# Altium schematic sheet AFE.SchDoc (part 2 of 3)
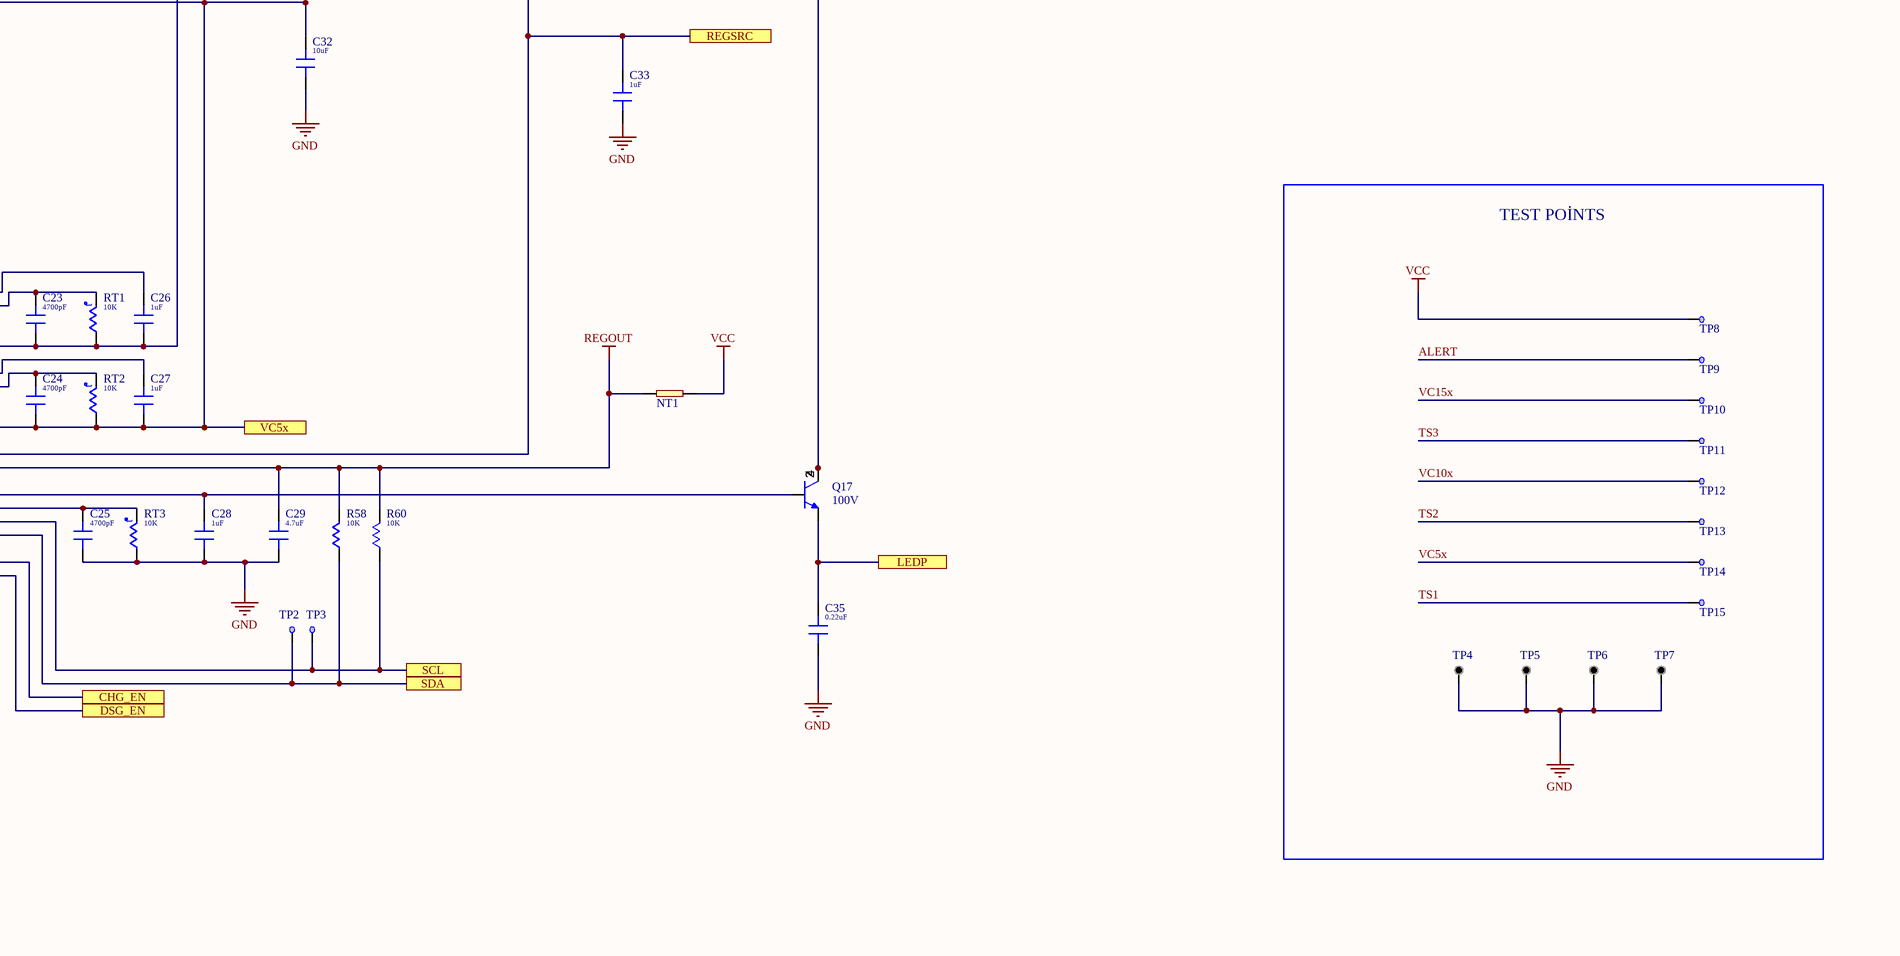
[diagram p4: AFE.SchDoc, bottom right]
## Library data of the parts
C1-C18 C35 = C_0.22uF_0603_16V: Ceramic Capacitor 220nF, 16VDC, 0603, ±10 %; Manufacturer: Wurth Electronics; Insulation Resistance: 2.3GR; Supplier: Mouser; Supplier Part Number: 710-885012206048; Manufacturer Part Number: 885012206048; RoHS: Yes; Category: Ceramic Capacitors; Stock: 28778; Pricing: 1=0,1, 10=0,044, 50=0,044, 100=0,04, 1000=0,035, 10000=0,029 (USD); Height: 800um; ComponentLink1URL: http://www.farnell.com/datasheets/1995922.pdf?src-supplier=Farnell; ComponentLink1Description: http://www.farnell.com/datasheets/1995922.pdf?src-supplier=Farnell; ComponentLink2URL: https://katalog.we-online.de/pbs/datasheet/885012206048.pdf?src-supplier=Digikey; ComponentLink2Description: https://katalog.we-online.de/pbs/datasheet/885012206048.pdf?src-supplier=Digikey; ComponentLink3URL: https://datasheet.octopart.com/885012206048-W%C3%BCrth-Elektronik-datasheet-61282229.pdf?src-supplier=Element14; ComponentLink3Description: https://datasheet.octopart.com/885012206048-W%C3%BCrth-Elektronik-datasheet-61282229.pdf?src-supplier=Element14
C19 C20 C22 = C_0.1uF_0603_50V: Ceramic Capacitor, Multilayer, Ceramic, 50V, 10% -Tol, X7R, 15% Tc, 0.1Uf, Surface Mount, 0603; Manufacturer: TDK; Material: 4241ConductorMaterial; Supplier: Mouser; Supplier Part Number: 810-C1608X7R1H104K; Manufacturer Part Number: C1608X7R1H104K080AA; RoHS: Yes; Category: Ceramic Capacitors; Stock: 870852; Pricing: 1=0,1, 10=0,041, 50=0,041, 100=0,024, 1000=0,018, 10000=0,015 (USD); Mounting Technology: Surface Mount; Case/Package: 0603; Pins: 2NUMBER; Case Code (Imperial): 0603; Case Code (Metric): 1608; Dielectric Material: 4241ConductorMaterial; Min Operating Temperature: -55°C; Max Operating Temperature: 125°C; Voltage Rating: 50V; Tolerance: 10%; Packaging: Tape and Reel; Package Quantity: 1; Dielectric: X7R; Termination: SMD/SMT; Voltage: 50V; Series: C; Construction: Flat; Length: 1.6mm; Width: 0.031inch; Height: 0.8mm; Thickness: 0.037inch; Depth: 0.8mm; Reach SVHC Compliant: No; RoHS Compliant: Yes; Lead Free: 5697LeadFree
C21 C36 = C_470pF_0603_50V: WCAP-CSGP 0603 (1608Metric) Ceramic Capacitor 0.063Lx0.031W 1.60mmx0.80mm X7R ±10% 470pF; Manufacturer: Wurth Electronics; Dielectric: 1511DielectricType; Insulation Resistance: 10GR; Voltage Rating (DC): 50V; Supplier: Digikey; Supplier Part Number: 732-7999-1-ND; Manufacturer Part Number: 885012206081; RoHS: Yes; Category: Ceramic Capacitors; Stock: 6003; Pricing: 1=0,1, 10=0,025, 100=0,023, 500=0,02 (USD); Height: 800um; ComponentLink1URL: http://www.farnell.com/datasheets/2031849.pdf?src-supplier=Farnell; ComponentLink1Description: http://www.farnell.com/datasheets/2031849.pdf?src-supplier=Farnell; ComponentLink2URL: http://www.farnell.com/datasheets/2031849.pdf?src-supplier=Newark; ComponentLink2Description: http://www.farnell.com/datasheets/2031849.pdf?src-supplier=Newark; ComponentLink3URL: http://katalog.we-online.de/pbs/datasheet/885012206081.pdf?src-supplier=Digikey; ComponentLink3Description: http://katalog.we-online.de/pbs/datasheet/885012206081.pdf?src-supplier=Digikey; ComponentLink4URL: https://katalog.we-online.de/pbs/datasheet/885012206081.pdf?src-supplier=Digikey; ComponentLink4Description: https://katalog.we-online.de/pbs/datasheet/885012206081.pdf?src-supplier=Digikey
C23-C25 = C_4700pF_0603_50V: Cap Cer 4700PF 50V X7R 0603; Manufacturer: Wurth Electronics; Tolerance: 10%; Insulation Resistance: 10GR; Supplier: Mouser; Supplier Part Number: 710-885012206087; Manufacturer Part Number: 885012206087; RoHS: Yes; Category: Ceramic Capacitors; Stock: 9914; Pricing: 1=0,1, 10=0,02, 50=0,02, 100=0,018, 1000=0,015, 10000=0,012 (USD); Mounting Technology: Surface Mount; Case/Package: 0603; Case Code (Metric): 1608; Case Code (Imperial): 0603; Min Operating Temperature: -55°C; Max Operating Temperature: 125°C; Packaging: Cut Tape; Voltage Rating: 50V; Dielectric: X7R; Voltage Rating (DC): 50V; Series: WCAP-CSGP; Length: 0.063inch; Width: 0.031inch; Height: 800um; Thickness: 0.037inch; RoHS Compliant: Yes; Reach SVHC Compliant: Unknown; ComponentLink1URL: http://www.farnell.com/datasheets/1958481.pdf?src-supplier=Farnell; ComponentLink1Description: http://www.farnell.com/datasheets/1958481.pdf?src-supplier=Farnell; ComponentLink2URL: https://datasheet.octopart.com/885012206087-W%C3%BCrth-Elektronik-datasheet-62053755.pdf?src-supplier=Element14; ComponentLink2Description: https://datasheet.octopart.com/885012206087-W%C3%BCrth-Elektronik-datasheet-62053755.pdf?src-supplier=Element14; ComponentLink3URL: https://katalog.we-online.de/pbs/datasheet/885012206087.pdf?src-supplier=Digikey; ComponentLink3Description: https://katalog.we-online.de/pbs/datasheet/885012206087.pdf?src-supplier=Digikey; ComponentLink4URL: http://www.farnell.com/datasheets/1958481.pdf?src-supplier=Newark; ComponentLink4Description: http://www.farnell.com/datasheets/1958481.pdf?src-supplier=Newark
C26-C28 = C_1uF_0603_16V: Capacitor, 1uF Multilayer Ceramic MLCC 16 V , X7R Dielectric 0603 Surface Mount | Wurth Electronics 885012206052; Material: 4241ConductorMaterial; Voltage Rating: 16V; Tolerance: 10%; Insulation Resistance: 100MR; Supplier: Mouser; Supplier Part Number: 710-885012206052; Manufacturer: Wurth Electronics; Manufacturer Part Number: 885012206052; RoHS: Yes; Category: Ceramic Capacitors; Stock: 13778; Pricing: 1=0,16, 10=0,153, 50=0,153, 100=0,141, 1000=0,123, 10000=0,11 (USD); Mounting Technology: Surface Mount; Case/Package: 0603; Case Code (Metric): 1608; Case Code (Imperial): 0603; Min Operating Temperature: -55°C; Max Operating Temperature: 125°C; Packaging: Cut Tape; Dielectric: X7R; Series: WCAP-CSGP; Voltage Rating (DC): 16V; Length: 0.063inch; Width: 0.031inch; Height: 800um; Thickness: 0.037inch; RoHS Compliant: Yes; Reach SVHC Compliant: Unknown; ComponentLink1URL: http://www.farnell.com/datasheets/1958472.pdf?src-supplier=Farnell; ComponentLink1Description: http://www.farnell.com/datasheets/1958472.pdf?src-supplier=Farnell; ComponentLink2URL: http://www.farnell.com/datasheets/1958472.pdf?src-supplier=Element14; ComponentLink2Description: http://www.farnell.com/datasheets/1958472.pdf?src-supplier=Element14; ComponentLink3URL: https://katalog.we-online.de/pbs/datasheet/885012206052.pdf?src-supplier=Digikey; ComponentLink3Description: https://katalog.we-online.de/pbs/datasheet/885012206052.pdf?src-supplier=Digikey; ComponentLink4URL: http://katalog.we-online.de/pbs/datasheet/885012206052.pdf?src-supplier=Digikey; ComponentLink4Description: http://katalog.we-online.de/pbs/datasheet/885012206052.pdf?src-supplier=Digikey; ComponentLink5URL: http://www.farnell.com/datasheets/1958472.pdf?src-supplier=Newark; ComponentLink5Description: http://www.farnell.com/datasheets/1958472.pdf?src-supplier=Newark
C29 = C_4.7uF_0805_10V: Multilayer Ceramic Capacitor, Wcap-Csgp Series, 4.7 F, 10%, X7R, 10 V, 0805 [2012 Metric] Rohs Compliant: Yes; Manufacturer: Wurth Electronics; Insulation Resistance: 20MR; Supplier: Mouser; Supplier Part Number: 710-885012207025; Manufacturer Part Number: 885012207025; RoHS: Yes; Category: Ceramic Capacitors; Stock: 5855; Pricing: 1=0,83, 10=0,765, 50=0,765, 100=0,705, 1000=0,612, 10000=0,551 (USD); Height: 1.25mm; ComponentLink1URL: http://www.farnell.com/datasheets/1958489.pdf?src-supplier=Farnell; ComponentLink1Description: http://www.farnell.com/datasheets/1958489.pdf?src-supplier=Farnell; ComponentLink2URL: http://www.farnell.com/datasheets/1958489.pdf?src-supplier=Element14; ComponentLink2Description: http://www.farnell.com/datasheets/1958489.pdf?src-supplier=Element14; ComponentLink3URL: https://katalog.we-online.de/pbs/datasheet/885012207025.pdf?src-supplier=Digikey; ComponentLink3Description: https://katalog.we-online.de/pbs/datasheet/885012207025.pdf?src-supplier=Digikey
C30-C32 = C_10uF_1210_35V: Multilayer Ceramic Capacitor, 10 uF, 35 V, ± 10%, X7R, 1210 [3225 Metric]; Manufacturer: Murata; Voltage Rating (DC): 35V; Supplier: Mouser; Supplier Part Number: 81-GRM32ER7YA106KA2L; Manufacturer Part Number: GRM32ER7YA106KA12L; RoHS: Yes; Category: Ceramic Capacitors; Stock: 33140; Pricing: 1=0,93, 10=0,661, 50=0,591, 100=0,487, 1000=0,341, 10000=0,298 (USD); Mounting Technology: Surface Mount; Case/Package: 1210; Case Code (Imperial): 1210; Case Code (Metric): 3225; Material: Ceramic; Min Operating Temperature: -55°C; Max Operating Temperature: 125°C; Tolerance: 10%; Dielectric: X7R; Packaging: Tape and Reel; Package Quantity: 1; Voltage Rating: 35V; Termination: SMD/SMT; Voltage: 35V; Series: GRM; Construction: Flat; Length: 3.2mm; Width: 0.098inch; Height: 2.5mm; Thickness: 0.106inch; Depth: 2.5mm; Radiation Hardening: No; Reach SVHC Compliant: No; RoHS Compliant: Yes; Lead Free: 5697LeadFree; ComponentLink1URL: https://datasheet.ciiva.com/22782/1747495-22782197.pdf?src-supplier=Farnell; ComponentLink1Description: https://datasheet.ciiva.com/22782/1747495-22782197.pdf?src-supplier=Farnell; ComponentLink2URL: https://datasheet.ciiva.com/11789/0900766b80ef921d-11789082.pdf?src-supplier=Rs; ComponentLink2Description: https://datasheet.ciiva.com/11789/0900766b80ef921d-11789082.pdf?src-supplier=Rs; ComponentLink3URL: https://datasheet.ciiva.com/3777/grm32er7ya106ka1223-3777248.pdf?src-supplier=Arrow+Electronics; ComponentLink3Description: https://datasheet.ciiva.com/3777/grm32er7ya106ka1223-3777248.pdf?src-supplier=Arrow+Electronics; ComponentLink4URL: https://datasheet.ciiva.com/29202/451166-da-01-de-vs-chip-kond-1210-10-0-uf-10pr-35-0v-x7r-29202478.pdf?src-supplier=Conrad; ComponentLink4Description: https://datasheet.ciiva.com/29202/451166-da-01-de-vs-chip-kond-1210-10-0-uf-10pr-35-0v-x7r-29202478.pdf?src-supplier=Conrad; ComponentLink5URL: https://datasheet.ciiva.com/29199/455226-da-01-en-vs-kondensator-1210-29199348.pdf?src-supplier=Conrad; ComponentLink5Description: https://datasheet.ciiva.com/29199/455226-da-01-en-vs-kondensator-1210-29199348.pdf?src-supplier=Conrad; ComponentLink6URL: https://datasheet.ciiva.com/14116/grmseries-highdielectrictype-eng-14116380.pdf?src-supplier=Distrelec; ComponentLink6Description: https://datasheet.ciiva.com/14116/grmseries-highdielectrictype-eng-14116380.pdf?src-supplier=Distrelec; ComponentLink7URL: https://datasheet.ciiva.com/7937/1747495-7937786.pdf?src-supplier=Element14; ComponentLink7Description: https://datasheet.ciiva.com/7937/1747495-7937786.pdf?src-supplier=Element14; ComponentLink8URL: https://datasheet.ciiva.com/143/partnumbering-e-01-143241.pdf?src-supplier=Digikey; ComponentLink8Description: https://datasheet.ciiva.com/143/partnumbering-e-01-143241.pdf?src-supplier=Digikey; ComponentLink9URL: https://datasheet.ciiva.com/143/partnumbering-e-01-143242.pdf?src-supplier=Digikey; ComponentLink9Description: https://datasheet.ciiva.com/143/partnumbering-e-01-143242.pdf?src-supplier=Digikey; ComponentLink10URL: https://datasheet.ciiva.com/11607/product-11607514.pdf?src-supplier=Avnet; ComponentLink10Description: https://datasheet.ciiva.com/11607/product-11607514.pdf?src-supplier=Avnet
C33 C34 = C_1uF_0805_50V: CAP CER 1UF 50V X7R 0805; Voltage-Rate: 25V; Tolerance: +-10%; Package / Case: 0805(2012 Metric); Operating Temperature: -55°C ~ 125°C; Temperature Coefficient: X7R
D1-D15 = D_ZENER_5.6V_SOD323: Diode Zener Single 5.6V 5% 200mW Automotive 2-Pin SOD-323 T/R; Manufacturer: Diodes; Supplier: Farnell; Supplier Part Number: 3127415; Manufacturer Part Number: MMSZ5232BS-7-F; RoHS: Yes; Category: Zener Diodes; Stock: 14029; Pricing: 5=0,206, 50=0,143, 100=0,0809, 500=0,052, 1500=0,051 (EUR); ComponentLink1URL: https://datasheet.ciiva.com/10640/ds31038-10640331.pdf?src-supplier=Avnet; ComponentLink1Description: https://datasheet.ciiva.com/10640/ds31038-10640331.pdf?src-supplier=Avnet; ComponentLink2URL: https://datasheet.ciiva.com/892/ds31038-892237.pdf?src-supplier=Digikey; ComponentLink2Description: https://datasheet.ciiva.com/892/ds31038-892237.pdf?src-supplier=Digikey; ComponentLink3URL: https://datasheet.ciiva.com/892/ds31038-892238.pdf?src-supplier=Digikey; ComponentLink3Description: https://datasheet.ciiva.com/892/ds31038-892238.pdf?src-supplier=Digikey; ComponentLink4URL: https://datasheet.ciiva.com/892/ds31038-892239.pdf?src-supplier=Digikey; ComponentLink4Description: https://datasheet.ciiva.com/892/ds31038-892239.pdf?src-supplier=Digikey; ComponentLink5URL: https://datasheet.ciiva.com/16463/ds31038-16463261.pdf?src-supplier=Future+Electronics; ComponentLink5Description: https://datasheet.ciiva.com/16463/ds31038-16463261.pdf?src-supplier=Future+Electronics
D16-D20 = D_GENPURP_100V_SOD123: Small Signal Diode, Single, 100 V, 300 mA, 1.25 V, 4 ns, 2 A RoHS Compliant: Yes; Manufacturer: Diodes; Forward Current: 150mA; Peak Non-Repetitive Surge Current: 2A; Forward Voltage: 1.25V; Reverse Recovery Time: 4ns; Max Reverse Current: 1uA; Average Rectified Current: 300mA; Power Dissipation: 400mW; Polarity: Standard; Voltage Rating (DC): 75V; Supplier: Future Electronics; Supplier Part Number: 4129355; Manufacturer Part Number: 1N4148W-7-F; RoHS: Yes; Category: LDO; Stock: 22659000; Pricing: 3000=0,0105, 12000=0,0099, 45000=0,0093, 60000=0,0094, 75000=0,0092, 120000=0,0092, 150000=0,0086, 375000=0,0086 (USD); Mounting Technology: Surface Mount; Pins: 2; Weight: 0.000353oz; Min Operating Temperature: -65°C; Max Operating Temperature: 150°C; Packaging: Tape and Reel; Max Repetitive Reverse Voltage (Vrrm): 100V; Max Forward Surge Current (Ifsm): 2A; Voltage: 100V; Max Surge Current: 2A; Package Quantity: 3000; Recovery Time: 4ns; Power Rating: 400mW; Current Rating: 150mA; Output Current: 150mA; Max Reverse Voltage (DC): 100V; Series: -; Reverse Recovery Time-Max: 4ns; Reverse Voltage: 100V; Length: 2.85mm; Width: 1.7mm; Height: 1.25mm; Radiation Hardening: No; Reach SVHC Compliant: No; RoHS Compliant: Yes; Lead Free: Lead Free; ComponentLink1URL: https://datasheet.ciiva.com/8303/ds30086-8303197.pdf?src-supplier=Avnet; ComponentLink1Description: https://datasheet.ciiva.com/8303/ds30086-8303197.pdf?src-supplier=Avnet; ComponentLink2URL: https://datasheet.ciiva.com/911/ds30086-911735.pdf?src-supplier=Digikey; ComponentLink2Description: https://datasheet.ciiva.com/911/ds30086-911735.pdf?src-supplier=Digikey; ComponentLink3URL: https://datasheet.ciiva.com/911/ds30086-911736.pdf?src-supplier=Digikey; ComponentLink3Description: https://datasheet.ciiva.com/911/ds30086-911736.pdf?src-supplier=Digikey; ComponentLink4URL: https://datasheet.ciiva.com/911/ds30086-911734.pdf?src-supplier=Digikey; ComponentLink4Description: https://datasheet.ciiva.com/911/ds30086-911734.pdf?src-supplier=Digikey; ComponentLink5URL: https://datasheet.ciiva.com/1179/1915529-1179304.pdf?src-supplier=Element14; ComponentLink5Description: https://datasheet.ciiva.com/1179/1915529-1179304.pdf?src-supplier=Element14; ComponentLink6URL: https://datasheet.ciiva.com/22695/1915529-22695239.pdf?src-supplier=Element14; ComponentLink6Description: https://datasheet.ciiva.com/22695/1915529-22695239.pdf?src-supplier=Element14; ComponentLink7URL: https://datasheet.ciiva.com/8300/ds30086-8300392.pdf?src-supplier=Avnet; ComponentLink7Description: https://datasheet.ciiva.com/8300/ds30086-8300392.pdf?src-supplier=Avnet; ComponentLink8URL: https://datasheet.ciiva.com/15219/getdatasheetpartid-110030-15219548.pdf?src-supplier=Verical; ComponentLink8Description: https://datasheet.ciiva.com/15219/getdatasheetpartid-110030-15219548.pdf?src-supplier=Verical; ComponentLink9URL: https://datasheet.ciiva.com/4435/ds30086-4435128.pdf?src-supplier=Mouser; ComponentLink9Description: https://datasheet.ciiva.com/4435/ds30086-4435128.pdf?src-supplier=Mouser
D21 D22 = D_ZENER_3.9V_SOD323: MMSZ5228BS Series 3.9 V 10 mA 200 mW Surface Mount Zener Diode - SOD-323; Manufacturer: Diodes; Supplier: Digikey; Supplier Part Number: MMSZ5228BS-FDICT-ND; Manufacturer Part Number: MMSZ5228BS-7-F; RoHS: Yes; Category: Zener Diodes; Stock: 78494; Pricing: 1=0,28, 10=0,191, 100=0,0933, 500=0,07784, 1000=0,05409 (USD); ComponentLink1URL: https://datasheet.ciiva.com/8348/ds31038-8348094.pdf?src-supplier=Avnet; ComponentLink1Description: https://datasheet.ciiva.com/8348/ds31038-8348094.pdf?src-supplier=Avnet; ComponentLink2URL: https://datasheet.ciiva.com/16465/ds31038-16465529.pdf?src-supplier=Future+Electronics; ComponentLink2Description: https://datasheet.ciiva.com/16465/ds31038-16465529.pdf?src-supplier=Future+Electronics; ComponentLink3URL: https://datasheet.ciiva.com/891/ds31038-891515.pdf?src-supplier=Digikey; ComponentLink3Description: https://datasheet.ciiva.com/891/ds31038-891515.pdf?src-supplier=Digikey; ComponentLink4URL: https://datasheet.ciiva.com/891/ds31038-891516.pdf?src-supplier=Digikey; ComponentLink4Description: https://datasheet.ciiva.com/891/ds31038-891516.pdf?src-supplier=Digikey; ComponentLink5URL: https://datasheet.ciiva.com/891/ds31038-891517.pdf?src-supplier=Digikey; ComponentLink5Description: https://datasheet.ciiva.com/891/ds31038-891517.pdf?src-supplier=Digikey
D23 = D_ZENER_18V_SOD323: Diode Zener Single 18V 5% 200mW Automotive 2-Pin SOD-323 T/R; Manufacturer: Diodes; Supplier: Mouser; Supplier Part Number: 621-MMSZ5248BS-F; Manufacturer Part Number: MMSZ5248BS-7-F; RoHS: Yes; Category: Zener Diodes; Stock: 6211; Pricing: 1=0,33, 10=0,22, 50=0,22, 100=0,094, 1000=0,072, 10000=0,05 (USD); ComponentLink1URL: https://datasheet.ciiva.com/8347/ds18010-8347928.pdf?src-supplier=Avnet; ComponentLink1Description: https://datasheet.ciiva.com/8347/ds18010-8347928.pdf?src-supplier=Avnet; ComponentLink2URL: https://datasheet.ciiva.com/892/ds31038-892342.pdf?src-supplier=Digikey; ComponentLink2Description: https://datasheet.ciiva.com/892/ds31038-892342.pdf?src-supplier=Digikey; ComponentLink3URL: https://datasheet.ciiva.com/892/ds31038-892343.pdf?src-supplier=Digikey; ComponentLink3Description: https://datasheet.ciiva.com/892/ds31038-892343.pdf?src-supplier=Digikey; ComponentLink4URL: https://datasheet.ciiva.com/892/ds31038-892344.pdf?src-supplier=Digikey; ComponentLink4Description: https://datasheet.ciiva.com/892/ds31038-892344.pdf?src-supplier=Digikey; ComponentLink5URL: https://datasheet.ciiva.com/8025/ds31038-8025788.pdf?src-supplier=Element14; ComponentLink5Description: https://datasheet.ciiva.com/8025/ds31038-8025788.pdf?src-supplier=Element14
J1 = J_TERMBLOCK_5POS_3.5MM: Conn Shrouded Header (4 Sides) HDR 5 POS 3.5mm Solder RA Side Entry Thru-Hole Eurostyle™; Manufacturer: Molex; Number of Circuits: 5; Contact Resistance: 8mR; Number of Levels: 1; Current: 8A; Voltage: 300V; Supplier: Mouser; Supplier Part Number: 538-39502-1005; Manufacturer Part Number: 0395021005; RoHS: Yes; Category: Terminal Blocks; Stock: 4358; Pricing: 1=1,27, 10=1,05, 50=1,05, 100=0,911, 1000=0,767, 10000=0,736 (USD); Mounting Technology: Through Hole; Color: Black; Contact Plating: Tin; Contact Material: Brass; Housing Color: Black; Housing Material: Polyamide; Min Operating Temperature: -40°C; Max Operating Temperature: 105°C; Orientation: Right Angle; Number of Rows: 1; Number of Positions Per Level: 5; Termination: Solder; Number of Positions: 5; Number of Contacts: 5; Series: Eurostyle ESE 39502; Length: 18.89mm; Width: 9.2mm; Pitch: 3.5mm; Depth: 9.2mm; RoHS Compliant: Yes; Reach SVHC Compliant: Yes; ELV: Compliant; Halogen Free: Low Halogen; Lead Free: Lead Free; Flammability Rating: UL94 V-0; ComponentLink1URL: https://datasheet.ciiva.com/796/395021002-sd-796528.pdf?src-supplier=Digikey; ComponentLink1Description: https://datasheet.ciiva.com/796/395021002-sd-796528.pdf?src-supplier=Digikey; ComponentLink2URL: https://datasheet.ciiva.com/30070/193400395021005-terminal-blocks-30070143.pdf?src-supplier=Onlinecomponents.com; ComponentLink2Description: https://datasheet.ciiva.com/30070/193400395021005-terminal-blocks-30070143.pdf?src-supplier=Onlinecomponents.com
J2 = J_TERMBLOCK_11POS_3.5MM: Conn Shrouded Header (4 Sides) HDR 11 POS 3.5mm Solder RA Thru-Hole Eurostyle™; Manufacturer: Molex; Contact Resistance: 8mR; Number of Positions: 11; Number of Levels: 1; Current: 8A; Voltage: 300V; Gender: Male; Supplier: Mouser; Supplier Part Number: 538-39502-1011; Manufacturer Part Number: 0395021011; RoHS: Yes; Category: Uncategorized; Stock: 342; Pricing: 1=2,11, 10=1,87, 50=1,84, 100=1,6, 1000=1,48, 10000=1,37 (USD); Contact Plating: Tin; Contact Material: Brass; Housing Color: Black; Housing Material: Polyamide; Color: Black; Min Operating Temperature: -40°C; Max Operating Temperature: 105°C; Number of Rows: 1; Termination: Solder; Orientation: Right Angle; Series: Eurostyle ESE 39502; Number of Positions Per Level: 11; Length: 39.89mm; Pitch: 3.5mm; Depth: 9.2mm; Flammability Rating: UL94 V-0; RoHS Compliant: Yes; ComponentLink1URL: http://components.arrow.com/part/dataview/44158219S9305424N3303?src-supplier=Arrow+Electronics; ComponentLink1Description: http://components.arrow.com/part/dataview/44158219S9305424N3303?src-supplier=Arrow+Electronics; ComponentLink2URL: https://www.molex.com/pdm_docs/sd/395021002_sd.pdf?src-supplier=Digikey; ComponentLink2Description: https://www.molex.com/pdm_docs/sd/395021002_sd.pdf?src-supplier=Digikey
NT1 = NET_TİE_1: Single point connection between nets.
Q1-Q15 = Q_MOSFET_12V_PICOSTAR3: MOSFET N-CH 12V 2.1A 3PICOSTAR / Trans MOSFET N-CH 12V 2.1A 3-Pin PicoStar T/R; Manufacturer: Texas Instruments; Supplier: Mouser; Supplier Part Number: 595-CSD13381F4; Manufacturer Part Number: CSD13381F4; RoHS: Yes; Category: MOSFETs; Stock: 84819; Pricing: 1=0,36, 10=0,274, 50=0,274, 100=0,155, 1000=0,078, 10000=0,054 (USD); ComponentLink1URL: https://datasheet.ciiva.com/29742/csd13381f4-29742944.pdf?src-supplier=Digikey; ComponentLink1Description: https://datasheet.ciiva.com/29742/csd13381f4-29742944.pdf?src-supplier=Digikey; ComponentLink2URL: https://datasheet.ciiva.com/30021/csd13381f4-30021964.pdf?src-supplier=Avnet; ComponentLink2Description: https://datasheet.ciiva.com/30021/csd13381f4-30021964.pdf?src-supplier=Avnet
Q16 = Q_MOSFET_100V_SOT23: MOSFET N-CH 100V 190MA SOT-23; Manufacturer: Nexperia; Supplier: Digikey; Supplier Part Number: 1727-4937-6-ND; Manufacturer Part Number: BST82,215; RoHS: Yes; Category: MOSFETs; Stock: 30276; Pricing: 1=0,38, 10=0,295, 100=0,1773, 500=0,16412, 1000=0,1116 (USD); ComponentLink1URL: http://www.farnell.com/datasheets/66837.pdf?src-supplier=Farnell; ComponentLink1Description: http://www.farnell.com/datasheets/66837.pdf?src-supplier=Farnell; ComponentLink2URL: http://www.farnell.com/datasheets/2871798.pdf?src-supplier=Farnell; ComponentLink2Description: http://www.farnell.com/datasheets/2871798.pdf?src-supplier=Farnell; ComponentLink3URL: https://datasheet.octopart.com/BST82%2C215-Nexperia-datasheet-8366983.pdf?src-supplier=Newark; ComponentLink3Description: https://datasheet.octopart.com/BST82%2C215-Nexperia-datasheet-8366983.pdf?src-supplier=Newark; ComponentLink4URL: http://www.farnell.com/datasheets/2871798.pdf?src-supplier=Newark; ComponentLink4Description: http://www.farnell.com/datasheets/2871798.pdf?src-supplier=Newark; ComponentLink5URL: https://assets.nexperia.com/documents/data-sheet/BST82.pdf?src-supplier=Digikey; ComponentLink5Description: https://assets.nexperia.com/documents/data-sheet/BST82.pdf?src-supplier=Digikey
Q17 = Q_BJT_100V_SOT-89-3: TRANS NPN 100V 5.25A SOT89; Manufacturer: Diodes Zetex; Supplier: Mouser; Supplier Part Number: 621-ZXTN19100CZTA; Manufacturer Part Number: ZXTN19100CZTA; RoHS: Yes; Category: BJTs; Stock: 1677; Pricing: 1=0,63, 10=0,551, 50=0,551, 100=0,401, 1000=0,319, 10000=0,283 (USD); ComponentLink1URL: https://datasheet.ciiva.com/980/zxtn19100cz-980400.pdf?src-supplier=Digikey; ComponentLink1Description: https://datasheet.ciiva.com/980/zxtn19100cz-980400.pdf?src-supplier=Digikey; ComponentLink2URL: https://datasheet.ciiva.com/11207/zxtn19100cz-11207318.pdf?src-supplier=Avnet; ComponentLink2Description: https://datasheet.ciiva.com/11207/zxtn19100cz-11207318.pdf?src-supplier=Avnet; ComponentLink3URL: https://datasheet.ciiva.com/980/zxtn19100cz-980401.pdf?src-supplier=Digikey; ComponentLink3Description: https://datasheet.ciiva.com/980/zxtn19100cz-980401.pdf?src-supplier=Digikey; ComponentLink4URL: https://datasheet.ciiva.com/980/zxtn19100cz-980402.pdf?src-supplier=Digikey; ComponentLink4Description: https://datasheet.ciiva.com/980/zxtn19100cz-980402.pdf?src-supplier=Digikey
Q18 Q20 = Q_MOSFET_100V_SOT23-3: Transistor MOSFET Negative Channel 100 Volt 0.17A 3-Pin SOT-23; Manufacturer: ON Semiconductor / Fairchild; Number of Channels: 1NUMBER; Supplier: Future Electronics; Supplier Part Number: 1056753; Manufacturer Part Number: BSS123; RoHS: Yes; Category: MOSFETs; Stock: 351000; Pricing: 3000=0,0465, 9000=0,0447, 15000=0,0439, 30000=0,0429, 60000=0,0412 (USD)
Q19 = Q_MOSFET_100V_SOT23-3_1: P-Channel 100 V 1 Ohm Surface Mount Enhancement Mode MOSFET - SOT-23; Manufacturer: Diodes Zetex; Current Rating: -500mA; Supplier: Future Electronics; Supplier Part Number: 3181252; Manufacturer Part Number: ZXMP10A13FTA; RoHS: Yes; Category: MOSFETs; Stock: 1053000; Pricing: 3000=0,16, 6000=0,157, 9000=0,155, 12000=0,154, 15000=0,15 (USD); Lead Free: 5697LeadFree; ComponentLink1URL: https://datasheet.ciiva.com/6383/zxmp10a13f-6383089.pdf?src-supplier=Digikey; ComponentLink1Description: https://datasheet.ciiva.com/6383/zxmp10a13f-6383089.pdf?src-supplier=Digikey; ComponentLink2URL: https://datasheet.ciiva.com/11175/zxmp10a13f-11175011.pdf?src-supplier=Avnet; ComponentLink2Description: https://datasheet.ciiva.com/11175/zxmp10a13f-11175011.pdf?src-supplier=Avnet; ComponentLink3URL: https://datasheet.ciiva.com/17097/zxmp10a13fta-17097946.pdf?src-supplier=Allied+Electronics; ComponentLink3Description: https://datasheet.ciiva.com/17097/zxmp10a13fta-17097946.pdf?src-supplier=Allied+Electronics; ComponentLink4URL: https://datasheet.ciiva.com/16387/zxmp10a13f-16387581.pdf?src-supplier=Future+Electronics; ComponentLink4Description: https://datasheet.ciiva.com/16387/zxmp10a13f-16387581.pdf?src-supplier=Future+Electronics; ComponentLink5URL: https://datasheet.ciiva.com/22712/1915646-22712428.pdf?src-supplier=Element14; ComponentLink5Description: https://datasheet.ciiva.com/22712/1915646-22712428.pdf?src-supplier=Element14; ComponentLink6URL: https://datasheet.ciiva.com/6383/zxmp10a13f-6383087.pdf?src-supplier=Digikey; ComponentLink6Description: https://datasheet.ciiva.com/6383/zxmp10a13f-6383087.pdf?src-supplier=Digikey
R1-R15 = R_28.7OHM_%1_3/4W_2010: SMD Chip Resistor, 28.7 Ohm, ± 1%, 750 mW, 2010 [5025 Metric], Thick Film, General Purpose; Manufacturer: Vishay Dale; Supplier: Mouser; Supplier Part Number: 71-CRCW201028R7FKEF; Manufacturer Part Number: CRCW201028R7FKEF; RoHS: Yes; Category: Chip SMD Resistors; Stock: 2759; Pricing: 1=0,25, 10=0,091, 50=0,091, 100=0,058, 1000=0,045, 10000=0,03 (USD); ComponentLink1URL: https://datasheet.ciiva.com/2477/dcrcwe3-2477004.pdf?src-supplier=Digikey; ComponentLink1Description: https://datasheet.ciiva.com/2477/dcrcwe3-2477004.pdf?src-supplier=Digikey; ComponentLink2URL: https://datasheet.ciiva.com/2477/dcrcwe3-2477005.pdf?src-supplier=Digikey; ComponentLink2Description: https://datasheet.ciiva.com/2477/dcrcwe3-2477005.pdf?src-supplier=Digikey; ComponentLink3URL: https://datasheet.ciiva.com/2477/dcrcwe3-2477006.pdf?src-supplier=Digikey; ComponentLink3Description: https://datasheet.ciiva.com/2477/dcrcwe3-2477006.pdf?src-supplier=Digikey
R16 R17 R19 R21 R23 R25 R27-R29 R31 R33 R35 R37 R39-R41 R43 R45 R47 R49 R51 R66 R68 = R_1K_%5_1/10W_0603: SMD Chip Resistor, 1 kOhm, ± 5%, 100 mW, 0603 [1608 Metric], Thick Film, General Purpose; Manufacturer: Vishay Dale; Temperature Coefficient: 200ppm/°C; Voltage Rating (DC): 75V; Power Rating: 100mW; Supplier: Mouser; Supplier Part Number: 71-CRCW0603J-1.0K-E3; Manufacturer Part Number: CRCW06031K00JNEA; RoHS: Yes; Category: Chip SMD Resistors; Stock: 120124; Pricing: 1=0,1, 10=0,016, 50=0,016, 100=0,009, 1000=0,006, 10000=0,003 (USD); Case/Package: 0603; Pins: 2; Contact Plating: Tin; Case Code (Metric): 1608; Case Code (Imperial): 0603; Weight: 7.1E-05oz; Min Operating Temperature: -55°C; Max Operating Temperature: 155°C; Tolerance: 5%; Resistor Type: Thick Film; Packaging: Tape and Reel; Package Quantity: 1; Voltage Rating: 75V; Number of Terminations: 2; Termination: SMD/SMT; Max Power Dissipation: 100mW; Features: Automotive AEC-Q200; Series: CRCW; Resistance Tolerance: 5%; Construction: Rectangular; Length: 1.55mm; Width: 0.033inch; Height: 0.02inch; Depth: 0.85mm; Radiation Hardening: No; Lead Free: Lead Free; RoHS Compliant: Yes; Reach SVHC Compliant: Unknown; Military Standard: Not; ComponentLink1URL: https://datasheet.ciiva.com/46441/1533075-46441625.pdf?src-supplier=Element14; ComponentLink1Description: https://datasheet.ciiva.com/46441/1533075-46441625.pdf?src-supplier=Element14; ComponentLink2URL: https://datasheet.ciiva.com/28621/1847332-28621386.pdf?src-supplier=Element14; ComponentLink2Description: https://datasheet.ciiva.com/28621/1847332-28621386.pdf?src-supplier=Element14; ComponentLink3URL: https://datasheet.ciiva.com/2462/dcrcwe3-2462023.pdf?src-supplier=Digikey; ComponentLink3Description: https://datasheet.ciiva.com/2462/dcrcwe3-2462023.pdf?src-supplier=Digikey; ComponentLink4URL: https://datasheet.ciiva.com/2462/dcrcwe3-2462024.pdf?src-supplier=Digikey; ComponentLink4Description: https://datasheet.ciiva.com/2462/dcrcwe3-2462024.pdf?src-supplier=Digikey; ComponentLink5URL: https://datasheet.ciiva.com/2462/dcrcwe3-2462022.pdf?src-supplier=Digikey; ComponentLink5Description: https://datasheet.ciiva.com/2462/dcrcwe3-2462022.pdf?src-supplier=Digikey; ComponentLink6URL: https://datasheet.ciiva.com/5548/dcrcwe3-109170-5548152.pdf?src-supplier=Mouser; ComponentLink6Description: https://datasheet.ciiva.com/5548/dcrcwe3-109170-5548152.pdf?src-supplier=Mouser; ComponentLink7URL: https://datasheet.ciiva.com/16211/dcrcwe3-16211589.pdf?src-supplier=Future+Electronics; ComponentLink7Description: https://datasheet.ciiva.com/16211/dcrcwe3-16211589.pdf?src-supplier=Future+Electronics
R18 R20 R22 R24 R26 R30 R32 R34 R36 R38 R42 R44 R46 R48 R50 R58 R60 = R_10K_%5_1/10W_0603: SMD Chip Resistor, 10 kOhm, ± 5%, 100 mW, 0603 [1608 Metric], Thick Film, General Purpose; Manufacturer: Vishay Dale; Temperature Coefficient: 200ppm/°C; Voltage Rating (DC): 75V; Power Rating: 100mW; Supplier: Mouser; Supplier Part Number: 71-CRCW0603J-10K-E3; Manufacturer Part Number: CRCW060310K0JNEA; RoHS: Yes; Category: Chip SMD Resistors; Stock: 615842; Pricing: 1=0,1, 10=0,016, 50=0,016, 100=0,009, 1000=0,006, 10000=0,004 (USD); Mounting Technology: Surface Mount; Case/Package: 0603; Pins: 2NUMBER; Case Code (Metric): 1608; Case Code (Imperial): 0603; Contact Plating: Tin; Weight: 7.1E-05oz; Min Operating Temperature: -55°C; Max Operating Temperature: 155°C; Tolerance: 5%; Packaging: Tape and Reel; Voltage Rating: 75V; Resistor Type: Thick Film; Number of Terminations: 2; Termination: SMD/SMT; Max Power Dissipation: 100mW; Features: Automotive AEC-Q200; Series: CRCW; Resistance Tolerance: 5%; Package Quantity: 1; Construction: Rectangular; Length: 1.55mm; Width: 0.033inch; Height: 0.02inch; Depth: 0.85mm; Ratings: AEC-Q200; Radiation Hardening: No; RoHS Compliant: Yes; Reach SVHC Compliant: Unknown; Lead Free: 5697LeadFree; Military Standard: Not; ComponentLink1URL: https://datasheet.ciiva.com/2461/dcrcwe3-2461973.pdf?src-supplier=Digikey; ComponentLink1Description: https://datasheet.ciiva.com/2461/dcrcwe3-2461973.pdf?src-supplier=Digikey; ComponentLink2URL: https://datasheet.ciiva.com/16755/70201119-16755717.pdf?src-supplier=Allied+Electronics; ComponentLink2Description: https://datasheet.ciiva.com/16755/70201119-16755717.pdf?src-supplier=Allied+Electronics; ComponentLink3URL: https://datasheet.ciiva.com/3256/dcrcwe3-3256942.pdf?src-supplier=Avnet; ComponentLink3Description: https://datasheet.ciiva.com/3256/dcrcwe3-3256942.pdf?src-supplier=Avnet; ComponentLink4URL: https://datasheet.ciiva.com/16771/70201119-16771051.pdf?src-supplier=Allied+Electronics; ComponentLink4Description: https://datasheet.ciiva.com/16771/70201119-16771051.pdf?src-supplier=Allied+Electronics; ComponentLink5URL: https://datasheet.ciiva.com/3256/dcrcwe3-3256943.pdf?src-supplier=Avnet; ComponentLink5Description: https://datasheet.ciiva.com/3256/dcrcwe3-3256943.pdf?src-supplier=Avnet; ComponentLink6URL: https://datasheet.ciiva.com/16343/dcrcwe3-16343525.pdf?src-supplier=Future+Electronics; ComponentLink6Description: https://datasheet.ciiva.com/16343/dcrcwe3-16343525.pdf?src-supplier=Future+Electronics; ComponentLink7URL: https://datasheet.ciiva.com/2461/dcrcwe3-2461972.pdf?src-supplier=Digikey; ComponentLink7Description: https://datasheet.ciiva.com/2461/dcrcwe3-2461972.pdf?src-supplier=Digikey; ComponentLink8URL: https://datasheet.ciiva.com/2461/dcrcwe3-2461971.pdf?src-supplier=Digikey; ComponentLink8Description: https://datasheet.ciiva.com/2461/dcrcwe3-2461971.pdf?src-supplier=Digikey
R52-R54 = R_0OHM_1/10W_0603: Zero Ohm Resistor, Jumper, 0603 [1608 Metric], Thick Film, 330 mW, 5 A, Surface Mount; Manufacturer: Vishay Dale; Manufacturer Part Number: CRCW06030000Z0EAHP; Power Rating: 250mW; Voltage Rating: 75V; Temperature Coefficient: 0ppm/°C; Supplier: Mouser; Supplier Part Number: 71-CRCW06030000Z0EAH; RoHS: Yes; Category: Chip SMD Resistors; Stock: 1018937; Pricing: 1=0,14, 10=0,068, 50=0,068, 100=0,03, 1000=0,021, 10000=0,014 (USD); Case/Package: 0603; Pins: 2; Contact Plating: Tin; Case Code (Metric): 1608; Case Code (Imperial): 0603; Weight: 7.1E-05oz; Min Operating Temperature: -55°C; Max Operating Temperature: 155°C; Packaging: Tape and Reel; Resistor Type: Thick Film; Number of Terminations: 2; Termination: SMD/SMT; Max Power Dissipation: 250mW; Features: Automotive AEC-Q200; Series: CRCW-HP; Voltage Rating (DC): 75V; Package Quantity: 5000; Technology: THICK FILM; Construction: Rectangular; Length: 1.6mm; Width: 0.033inch; Height: 0.45mm; Depth: 0.85mm; Ratings: AEC-Q200; Radiation Hardening: No; Lead Free: 5697LeadFree; RoHS Compliant: Yes; Reach SVHC Compliant: Unknown; Military Standard: Not; ComponentLink1URL: https://datasheet.ciiva.com/8340/crcwhpe3-8340198.pdf?src-supplier=Avnet; ComponentLink1Description: https://datasheet.ciiva.com/8340/crcwhpe3-8340198.pdf?src-supplier=Avnet; ComponentLink2URL: https://datasheet.ciiva.com/16430/crcwhpe3-16430059.pdf?src-supplier=Future+Electronics; ComponentLink2Description: https://datasheet.ciiva.com/16430/crcwhpe3-16430059.pdf?src-supplier=Future+Electronics; ComponentLink3URL: https://datasheet.ciiva.com/2472/crcwhpe3-2472034.pdf?src-supplier=Digikey; ComponentLink3Description: https://datasheet.ciiva.com/2472/crcwhpe3-2472034.pdf?src-supplier=Digikey; ComponentLink4URL: https://datasheet.ciiva.com/2472/crcwhpe3-2472035.pdf?src-supplier=Digikey; ComponentLink4Description: https://datasheet.ciiva.com/2472/crcwhpe3-2472035.pdf?src-supplier=Digikey; ComponentLink5URL: https://datasheet.ciiva.com/2472/crcwhpe3-2472033.pdf?src-supplier=Digikey; ComponentLink5Description: https://datasheet.ciiva.com/2472/crcwhpe3-2472033.pdf?src-supplier=Digikey; ComponentLink6URL: https://datasheet.ciiva.com/28621/1912814-28621358.pdf?src-supplier=Element14; ComponentLink6Description: https://datasheet.ciiva.com/28621/1912814-28621358.pdf?src-supplier=Element14
R55 = R_499K_%1_1/10W_0603: SMD Chip Resistor, 499 kOhm, ± 1%, 100 mW, 0603 [1608 Metric], Thick Film, General Purpose; Manufacturer: Vishay; Supplier: Mouser; Supplier Part Number: 71-CRCW0603-499K-E3; Manufacturer Part Number: CRCW0603499KFKEA; RoHS: Yes; Category: Chip SMD Resistors; Stock: 28370; Pricing: 1=0,1, 10=0,017, 50=0,017, 100=0,01, 1000=0,007, 10000=0,004 (USD); Lead Free: 5697LeadFree; ComponentLink1URL: https://datasheet.ciiva.com/11811/0900766b80d98afc-11811204.pdf?src-supplier=Rs; ComponentLink1Description: https://datasheet.ciiva.com/11811/0900766b80d98afc-11811204.pdf?src-supplier=Rs; ComponentLink2URL: https://datasheet.ciiva.com/3257/dcrcwe3-3257647.pdf?src-supplier=Avnet; ComponentLink2Description: https://datasheet.ciiva.com/3257/dcrcwe3-3257647.pdf?src-supplier=Avnet; ComponentLink3URL: https://datasheet.ciiva.com/7168/1635184-7168517.pdf?src-supplier=Newark; ComponentLink3Description: https://datasheet.ciiva.com/7168/1635184-7168517.pdf?src-supplier=Newark; ComponentLink4URL: https://datasheet.ciiva.com/5551/dcrcwe3-109170-5551960.pdf?src-supplier=Mouser; ComponentLink4Description: https://datasheet.ciiva.com/5551/dcrcwe3-109170-5551960.pdf?src-supplier=Mouser; ComponentLink5URL: https://datasheet.ciiva.com/7792/125364-7792298.pdf?src-supplier=Element14; ComponentLink5Description: https://datasheet.ciiva.com/7792/125364-7792298.pdf?src-supplier=Element14; ComponentLink6URL: https://datasheet.ciiva.com/2465/dcrcwe3-2465609.pdf?src-supplier=Digikey; ComponentLink6Description: https://datasheet.ciiva.com/2465/dcrcwe3-2465609.pdf?src-supplier=Digikey; ComponentLink7URL: https://datasheet.ciiva.com/2465/dcrcwe3-2465610.pdf?src-supplier=Digikey; ComponentLink7Description: https://datasheet.ciiva.com/2465/dcrcwe3-2465610.pdf?src-supplier=Digikey; ComponentLink8URL: https://datasheet.ciiva.com/2465/dcrcwe3-2465611.pdf?src-supplier=Digikey; ComponentLink8Description: https://datasheet.ciiva.com/2465/dcrcwe3-2465611.pdf?src-supplier=Digikey
R56 R57 = R_100OHM_%1_1/8W_0805: SMD Chip Resistor, 100 Ohm, ± 1%, 125 mW, 0805 [2012 Metric], Thick Film, General Purpose; Manufacturer: Vishay Dale; Voltage Rating: 150V; Temperature Coefficient: 100ppm/°C; Power Rating: 125mW; Supplier: Mouser; Supplier Part Number: 71-CRCW0805-100-E3; Manufacturer Part Number: CRCW0805100RFKEA; RoHS: Yes; Category: Chip SMD Resistors; Stock: 528495; Pricing: 1=0,1, 10=0,025, 50=0,025, 100=0,015, 1000=0,011, 10000=0,006 (USD); Case/Package: 0805; Pins: 2NUMBER; Weight: 0.000194oz; Case Code (Metric): 2012; Case Code (Imperial): 0805; Contact Plating: Tin; Min Operating Temperature: -55°C; Max Operating Temperature: 155°C; Voltage Rating (DC): 150V; Package Quantity: 10; Tolerance: 1%; Packaging: Tape and Reel; Resistor Type: Thick Film; Number of Terminations: 2; Termination: SMD/SMT; Max Power Dissipation: 125mW; Features: Automotive AEC-Q200; Series: CRCW; Technology: THICK FILM; Construction: Rectangular; Resistance Tolerance: 1%; Length: 2mm; Width: 0.049inch; Height: 0.45mm; Depth: 1.25mm; Radiation Hardening: No; Lead Free: 5697LeadFree; Military Standard: Not; RoHS Compliant: Yes; Reach SVHC Compliant: Unknown; ComponentLink1URL: https://datasheet.ciiva.com/11809/0900766b80d98b26-11809126.pdf?src-supplier=Rs; ComponentLink1Description: https://datasheet.ciiva.com/11809/0900766b80d98b26-11809126.pdf?src-supplier=Rs; ComponentLink2URL: https://datasheet.ciiva.com/5546/dcrcwe3-109170-5546700.pdf?src-supplier=Mouser; ComponentLink2Description: https://datasheet.ciiva.com/5546/dcrcwe3-109170-5546700.pdf?src-supplier=Mouser; ComponentLink3URL: https://datasheet.ciiva.com/2495/dcrcwe3-2495843.pdf?src-supplier=Digikey; ComponentLink3Description: https://datasheet.ciiva.com/2495/dcrcwe3-2495843.pdf?src-supplier=Digikey; ComponentLink4URL: https://datasheet.ciiva.com/2495/dcrcwe3-2495844.pdf?src-supplier=Digikey; ComponentLink4Description: https://datasheet.ciiva.com/2495/dcrcwe3-2495844.pdf?src-supplier=Digikey; ComponentLink5URL: https://datasheet.ciiva.com/2495/dcrcwe3-2495842.pdf?src-supplier=Digikey; ComponentLink5Description: https://datasheet.ciiva.com/2495/dcrcwe3-2495842.pdf?src-supplier=Digikey; ComponentLink6URL: https://datasheet.ciiva.com/16760/70201119-16760940.pdf?src-supplier=Allied+Electronics; ComponentLink6Description: https://datasheet.ciiva.com/16760/70201119-16760940.pdf?src-supplier=Allied+Electronics; ComponentLink7URL: https://datasheet.ciiva.com/16777/70201119-16777129.pdf?src-supplier=Allied+Electronics; ComponentLink7Description: https://datasheet.ciiva.com/16777/70201119-16777129.pdf?src-supplier=Allied+Electronics; ComponentLink8URL: https://datasheet.ciiva.com/8337/dcrcwe3-8337753.pdf?src-supplier=Avnet; ComponentLink8Description: https://datasheet.ciiva.com/8337/dcrcwe3-8337753.pdf?src-supplier=Avnet; ComponentLink9URL: https://datasheet.ciiva.com/3258/dcrcwe3-3258011.pdf?src-supplier=Avnet; ComponentLink9Description: https://datasheet.ciiva.com/3258/dcrcwe3-3258011.pdf?src-supplier=Avnet; ComponentLink10URL: https://datasheet.ciiva.com/15159/getdatasheetpartid-90825-15159895.pdf?src-supplier=Verical; ComponentLink10Description: https://datasheet.ciiva.com/15159/getdatasheetpartid-90825-15159895.pdf?src-supplier=Verical
R59 R61 R67 = R_100K_%1_1/8W_0805: SMD Chip Resistor, 100 kOhm, ± 1%, 125 mW, 0805 [2012 Metric], Thick Film, General Purpose; Manufacturer: Vishay; Voltage Rating (DC): 150V; Power Rating: 125mW; Temperature Coefficient: 100ppm/°C; Supplier: Mouser; Supplier Part Number: 71-CRCW0805-100K-E3; Manufacturer Part Number: CRCW0805100KFKEA; RoHS: Yes; Category: Chip SMD Resistors; Stock: 147322; Pricing: 1=0,1, 10=0,025, 50=0,025, 100=0,015, 1000=0,011, 10000=0,007 (USD); Case/Package: 0805; Pins: 2; Weight: 0.000194oz; Case Code (Imperial): 0805; Case Code (Metric): 2012; Contact Plating: Tin; Min Operating Temperature: -55°C; Max Operating Temperature: 155°C; Tolerance: 1%; Resistor Type: Thick Film; Packaging: Tape and Reel; Voltage Rating: 150V; Package Quantity: 5000; Termination: SMD/SMT; Features: Automotive AEC-Q200; Series: CRCW; Max Power Dissipation: 125mW; Number of Terminations: 2; Technology: THICK FILM; Construction: Rectangular; Resistance Tolerance: 1%; Length: 2mm; Width: 1.25mm; Height: 0.45mm; Depth: 1.25mm; Ratings: AEC-Q200; Radiation Hardening: No; Lead Free: 5697LeadFree; Military Standard: Not; RoHS Compliant: Yes; Reach SVHC Compliant: Unknown; ComponentLink1URL: https://datasheet.ciiva.com/7777/1697337-7777349.pdf?src-supplier=Element14; ComponentLink1Description: https://datasheet.ciiva.com/7777/1697337-7777349.pdf?src-supplier=Element14
R62 = R_1K_%5_3/4W_2010: Res Thick Film 2010 1K Ohm 5% 0.75W(3/4W) ±200ppm/°C Pad SMD Automotive T/R; Manufacturer: Vishay Dale; Supplier: Mouser; Supplier Part Number: 71-CRCW2010J-1K-E3; Manufacturer Part Number: CRCW20101K00JNEF; RoHS: Yes; Category: Chip SMD Resistors; Stock: 11217; Pricing: 1=0,26, 10=0,093, 50=0,093, 100=0,059, 1000=0,045, 10000=0,034 (USD); ComponentLink1URL: https://datasheet.ciiva.com/7695/1778090-7695006.pdf?src-supplier=Element14; ComponentLink1Description: https://datasheet.ciiva.com/7695/1778090-7695006.pdf?src-supplier=Element14; ComponentLink2URL: https://datasheet.ciiva.com/2476/dcrcwe3-2476404.pdf?src-supplier=Digikey; ComponentLink2Description: https://datasheet.ciiva.com/2476/dcrcwe3-2476404.pdf?src-supplier=Digikey; ComponentLink3URL: https://datasheet.ciiva.com/2476/dcrcwe3-2476405.pdf?src-supplier=Digikey; ComponentLink3Description: https://datasheet.ciiva.com/2476/dcrcwe3-2476405.pdf?src-supplier=Digikey; ComponentLink4URL: https://datasheet.ciiva.com/2476/dcrcwe3-2476406.pdf?src-supplier=Digikey; ComponentLink4Description: https://datasheet.ciiva.com/2476/dcrcwe3-2476406.pdf?src-supplier=Digikey; ComponentLink5URL: https://datasheet.ciiva.com/9112/dcrcwe3-9112279.pdf?src-supplier=Avnet; ComponentLink5Description: https://datasheet.ciiva.com/9112/dcrcwe3-9112279.pdf?src-supplier=Avnet; ComponentLink6URL: https://datasheet.ciiva.com/22868/70201119-22868952.pdf?src-supplier=Allied+Electronics; ComponentLink6Description: https://datasheet.ciiva.com/22868/70201119-22868952.pdf?src-supplier=Allied+Electronics; ComponentLink7URL: https://datasheet.ciiva.com/48527/dcrcwe3-48527642.pdf?src-supplier=Avnet; ComponentLink7Description: https://datasheet.ciiva.com/48527/dcrcwe3-48527642.pdf?src-supplier=Avnet
R63 = R_750OHM_%5_3/4W_2010: SMD Chip Resistor, 750 Ohm, ± 5%, 750 mW, 2010 [5025 Metric], Thick Film, General Purpose; Manufacturer: Vishay Dale; Temperature Coefficient: 200ppm/°C; Max Power Dissipation: 750mW; Voltage Rating: 400V; Supplier: Mouser; Supplier Part Number: 71-CRCW2010750RJNEF; Manufacturer Part Number: CRCW2010750RJNEF; RoHS: Yes; Category: Chip SMD Resistors; Stock: 6201; Pricing: 1=0,26, 10=0,091, 50=0,091, 100=0,058, 1000=0,048, 10000=0,034 (USD); Case/Package: 2010; Weight: 0.001372oz; Case Code (Metric): 5025; Case Code (Imperial): 2010; Contact Plating: Tin; Min Operating Temperature: -55°C; Max Operating Temperature: 155°C; Packaging: Tape and Reel; Tolerance: 5%; Package Quantity: 4000; Number of Terminations: 2; Features: Automotive AEC-Q200; Series: CRCW; Power Rating: 750mW; Termination: SMD/SMT; Voltage Rating (DC): 400V; Length: 5mm; Width: 2.5mm; Height: 0.6mm; Ratings: AEC-Q200; Radiation Hardening: No; Lead Free: Lead Free; RoHS Compliant: Yes; ComponentLink1URL: https://datasheet.ciiva.com/2476/dcrcwe3-2476554.pdf?src-supplier=Digikey; ComponentLink1Description: https://datasheet.ciiva.com/2476/dcrcwe3-2476554.pdf?src-supplier=Digikey; ComponentLink2URL: https://datasheet.ciiva.com/2476/dcrcwe3-2476555.pdf?src-supplier=Digikey; ComponentLink2Description: https://datasheet.ciiva.com/2476/dcrcwe3-2476555.pdf?src-supplier=Digikey; ComponentLink3URL: https://datasheet.ciiva.com/2476/dcrcwe3-2476556.pdf?src-supplier=Digikey; ComponentLink3Description: https://datasheet.ciiva.com/2476/dcrcwe3-2476556.pdf?src-supplier=Digikey; ComponentLink4URL: https://datasheet.ciiva.com/8922/dcrcwe3-8922007.pdf?src-supplier=Avnet; ComponentLink4Description: https://datasheet.ciiva.com/8922/dcrcwe3-8922007.pdf?src-supplier=Avnet; ComponentLink5URL: https://datasheet.ciiva.com/16389/dcrcwe3-16389883.pdf?src-supplier=Future+Electronics; ComponentLink5Description: https://datasheet.ciiva.com/16389/dcrcwe3-16389883.pdf?src-supplier=Future+Electronics; ComponentLink6URL: https://datasheet.ciiva.com/5552/dcrcwe3-109170-5552367.pdf?src-supplier=Mouser; ComponentLink6Description: https://datasheet.ciiva.com/5552/dcrcwe3-109170-5552367.pdf?src-supplier=Mouser
R64 = R_51K_%5_1/10W_0603: SMD Chip Resistor, 51 kOhm, ± 5%, 100 mW, 0603 [1608 Metric], Thick Film, General Purpose; Manufacturer: Vishay Dale; Power Rating: 100mW; Temperature Coefficient: 200ppm/°C; Voltage Rating: 75V; Supplier: Mouser; Supplier Part Number: 71-CRCW0603J-51K-E3; Manufacturer Part Number: CRCW060351K0JNEA; RoHS: Yes; Category: Chip SMD Resistors; Stock: 13555; Pricing: 1=0,1, 10=0,016, 50=0,016, 100=0,009, 1000=0,007, 10000=0,004 (USD); Case/Package: 0603; Pins: 2; Weight: 7.1E-05oz; Case Code (Metric): 1608; Case Code (Imperial): 0603; Contact Plating: Tin; Min Operating Temperature: -55°C; Max Operating Temperature: 155°C; Tolerance: 5%; Packaging: Tape and Reel; Package Quantity: 1; Number of Terminations: 2; Termination: SMD/SMT; Max Power Dissipation: 100mW; Features: Automotive AEC-Q200; Series: CRCW; Resistor Type: Thick Film; Working Voltage: 75V; Construction: Rectangular; Resistance Tolerance: 5%; Technology: THICK FILM; Voltage Rating (DC): 75V; Length: 1.55mm; Width: 0.033inch; Height: 0.45mm; Depth: 0.85mm; Radiation Hardening: No; RoHS Compliant: Yes; Lead Free: 5697LeadFree; Military Standard: Not; Reach SVHC Compliant: Unknown; ComponentLink1URL: https://datasheet.ciiva.com/2462/dcrcwe3-2462332.pdf?src-supplier=Digikey; ComponentLink1Description: https://datasheet.ciiva.com/2462/dcrcwe3-2462332.pdf?src-supplier=Digikey; ComponentLink2URL: https://datasheet.ciiva.com/2462/dcrcwe3-2462333.pdf?src-supplier=Digikey; ComponentLink2Description: https://datasheet.ciiva.com/2462/dcrcwe3-2462333.pdf?src-supplier=Digikey; ComponentLink3URL: https://datasheet.ciiva.com/2462/dcrcwe3-2462331.pdf?src-supplier=Digikey; ComponentLink3Description: https://datasheet.ciiva.com/2462/dcrcwe3-2462331.pdf?src-supplier=Digikey; ComponentLink4URL: https://datasheet.ciiva.com/16759/70201119-16759035.pdf?src-supplier=Allied+Electronics; ComponentLink4Description: https://datasheet.ciiva.com/16759/70201119-16759035.pdf?src-supplier=Allied+Electronics; ComponentLink5URL: https://datasheet.ciiva.com/5542/dcrcwe3-109170-5542427.pdf?src-supplier=Mouser; ComponentLink5Description: https://datasheet.ciiva.com/5542/dcrcwe3-109170-5542427.pdf?src-supplier=Mouser; ComponentLink6URL: https://datasheet.ciiva.com/8337/dcrcwe3-8337247.pdf?src-supplier=Avnet; ComponentLink6Description: https://datasheet.ciiva.com/8337/dcrcwe3-8337247.pdf?src-supplier=Avnet